# Altium schematic sheet 其他.SchDoc
size A4
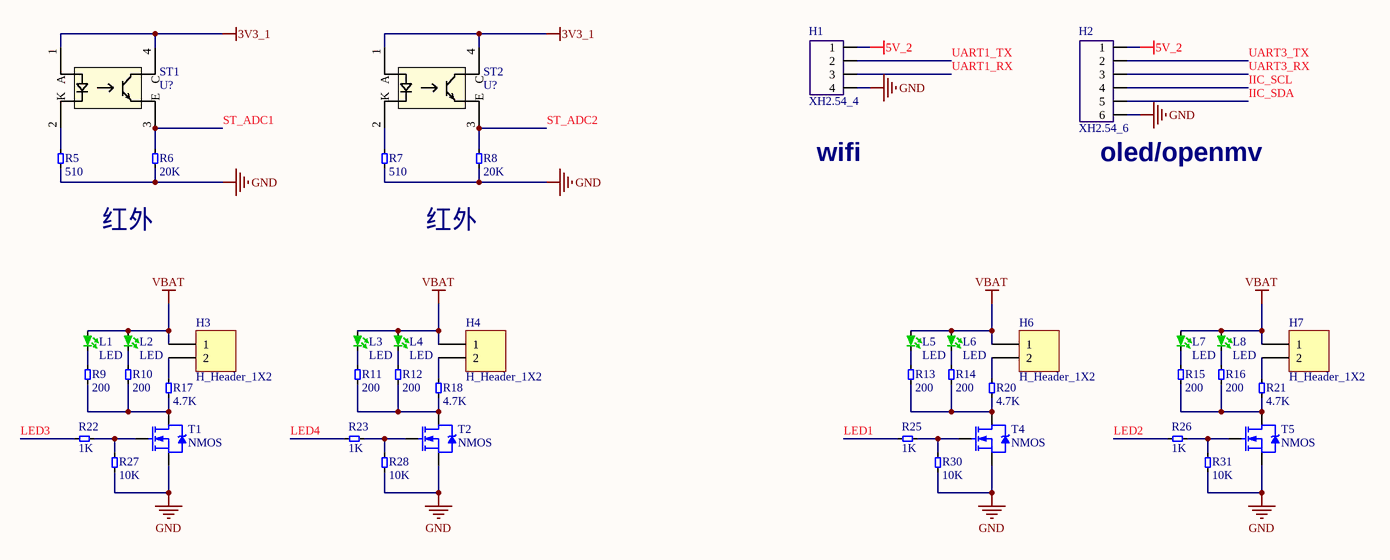
[diagram p0: 其他.SchDoc]

## Parts
H1  XH2.54_4  [H_XH2.54_4]
H2  XH2.54_6  [H_XH2.54_6]
H3  H_Header_1X2  [H_Header_1X2]
H4  H_Header_1X2  [H_Header_1X2]
H6  H_Header_1X2  [H_Header_1X2]
H7  H_Header_1X2  [H_Header_1X2]
L1  LED  [C_1206]
L2  LED  [C_1206]
L3  LED  [C_1206]
L4  LED  [C_1206]
L5  LED  [C_1206]
L6  LED  [C_1206]
L7  LED  [C_1206]
L8  LED  [C_1206]
R5  510  [R_0603]
R6  20K  [R_0603]
R7  510  [R_0603]
R8  20K  [R_0603]
R9  200  [R_0603]
R10  200  [R_0603]
R11  200  [R_0603]
R12  200  [R_0603]
R13  200  [R_0603]
R14  200  [R_0603]
R15  200  [R_0603]
R16  200  [R_0603]
R17  4.7K  [R_0603]
R18  4.7K  [R_0603]
R20  4.7K  [R_0603]
R21  4.7K  [R_0603]
R22  1K  [R_0603]
R23  1K  [R_0603]
R25  1K  [R_0603]
R26  1K  [R_0603]
R27  10K  [R_0603]
R28  10K  [R_0603]
R30  10K  [R_0603]
R31  10K  [R_0603]
ST1  U?  [ST188]
ST2  U?  [ST188]
T1  NMOS  [T_MOS_SOT-23]
T2  NMOS  [T_MOS_SOT-23]
T4  NMOS  [T_MOS_SOT-23]
T5  NMOS  [T_MOS_SOT-23]

## Nets
3V3_1: ST1.1(A) ST1.4(C) ST2.1(A) ST2.4(C)
5V_2: H1.1 H2.1
GND: H1.4 H2.6 R5.1 R6.1 R7.1 R8.1 R27.1 R28.1 R30.1 R31.1 T1.2(S) T2.2(S) T4.2(S) T5.2(S)
VBAT: H3.1 H4.1 H6.1 H7.1 L1.1 L2.1 L3.1 L4.1 L5.1 L6.1 L7.1 L8.1
IIC_SCL: H2.4
IIC_SDA: H2.5
LED1: R25.2
LED2: R26.2
LED3: R22.2
LED4: R23.2
ST_ADC1: R6.2 ST1.3(E)
ST_ADC2: R8.2 ST2.3(E)
UART1_RX: H1.3
UART1_TX: H1.2
UART3_RX: H2.3
UART3_TX: H2.2
NetH3_2: H3.2 R17.2
NetH4_2: H4.2 R18.2
NetH6_2: H6.2 R20.2
NetH7_2: H7.2 R21.2
NetL1_2: L1.2 R9.2
NetL2_2: L2.2 R10.2
NetL3_2: L3.2 R11.2
NetL4_2: L4.2 R12.2
NetL5_2: L5.2 R13.2
NetL6_2: L6.2 R14.2
NetL7_2: L7.2 R15.2
NetL8_2: L8.2 R16.2
NetR5_2: R5.2 ST1.2(K)
NetR7_2: R7.2 ST2.2(K)
NetR9_1: R9.1 R10.1 R17.1 T1.3(D)
NetR11_1: R11.1 R12.1 R18.1 T2.3(D)
NetR13_1: R13.1 R14.1 R20.1 T4.3(D)
NetR15_1: R15.1 R16.1 R21.1 T5.3(D)
NetR22_1: R22.1 R27.2 T1.1(G)
NetR23_1: R23.1 R28.2 T2.1(G)
NetR25_1: R25.1 R30.2 T4.1(G)
NetR26_1: R26.1 R31.2 T5.1(G)

## Notes on the sheet
- (near H1) wifi
- (near H2) oled/openmv
- 红外

## Library data of the parts
H1 = H_XH2.54_4: 4脚小白头; LatestRevisionDate: 17-Jul-2002; LatestRevisionNote: Re-released for DXP Platform.; Publisher: Altium Limited
H2 = H_XH2.54_6: 6脚小白头; LatestRevisionDate: 17-Jul-2002; LatestRevisionNote: Re-released for DXP Platform.; Publisher: Altium Limited
H3 H4 H6 H7 = H_Header_1X2: 单排2针排针; LatestRevisionDate: 17-Jul-2002; LatestRevisionNote: Re-released for DXP Platform.; Publisher: Altium Limited
L1-L8 = Y_LED_G: 绿色LED
R5-R18 R20-R23 R25-R28 R30 R31 = R_贴片: 贴片电阻
ST1 ST2 = ST188
T1 T2 T4 T5 = T_MOSFET_N: N沟道MOS管; Note: Pin 2 is electrically connected to pin 4.; Published: 8-Jun-2000; LatestRevisionDate: 17-Jul-2002; LatestRevisionNote: Re-released for DXP Platform.; DatasheetDocument: PD-9.814; PackageReference: TO-220AB; Publisher: Altium Limited; Code_JEDEC: TO-220-AB